# Altium schematic sheet Power.SchDoc
size A; SheetNumber: 1; SheetTotal: 6
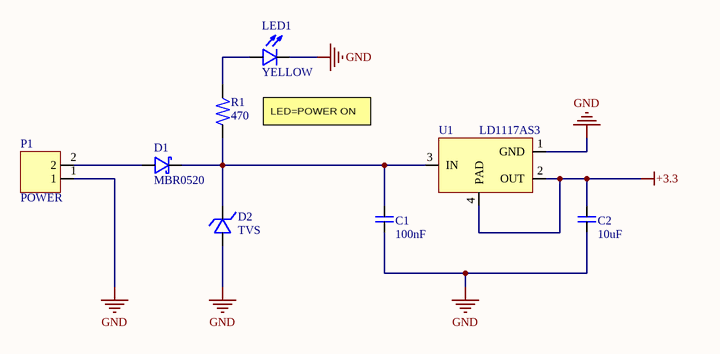
[diagram p0: Power.SchDoc]

## Parts
C1  100nF  [SMT_CAP_0805(2012)_X5R-KYOCERA]
C2  10uF  [SMT_CAP_1206(3216)_MURATA]
D1  MBR0520  [SMT_DIODE_SCH_SOD-123]
D2  TVS  [SMT_DIODE_TVS_SMB]
LED1  YELLOW  [SMT_LED_0805(2012)_WURTH]
P1  POWER  [THT_CON_WAFER_2P_LHE_C3004-WV02]
R1  470  [SMT_RES_0805(2012)]
U1  LD1117AS3  [SMT_VR_LD1117AS3]

## Nets
+3.3: C2.2 U1.2(OUT) U1.4(PAD)
GND: C1.1 C2.1 D2.1 LED1.1 P1.1 U1.1(GND)
NetC1_2: C1.2 D1.2 D2.2 R1.1 U1.3(IN)
NetD1_1: D1.1 P1.2
NetLED1_2: LED1.2 R1.2

## Notes on the sheet
- LED=POWER ON

## Library data of the parts
C1 = SMT_CAP_0805(2012)_X5R-KYOCERA: Multilayer Ceramic Capacitor 0805(2012) KYOCERA AVX 100nF 08055D104KAT2A 50VDC X5R
C2 = SMT_CAP_1206(3216)_MURATA: Ceramic Capacitor 1206(3216) MURATA 10uF 50VDC GCM31CD71H106KE36L X7T
D1 = SMT_DIODE_SCH_SOD-123: Schottky Diode If=500mA 20 V MBR0520L-TP SOD-123-2 by MCC
D2 = SMT_DIODE_TVS_SMB: Diode TVS Littelfuse 600W SZP6SMB6.8AT3G
LED1 = SMT_LED_0805(2012)_WURTH: LED 0805(2012) 20mA 2V 150080YS75000 by Wurth Elektronik
P1 = THT_CON_WAFER_2P_LHE_C3004-WV02: Connector Wafer LHE 2-Pin Pitch-3.00mm 250V/5A C3004-WV02
R1 = SMT_RES_0805(2012): 0805(2012) Resistor 1/4-1/8W 150V 2A
U1 = SMT_VR_LD1117AS3: Voltage Regulator ST LD1117AS33TR 1A 3.3V 10Vmax